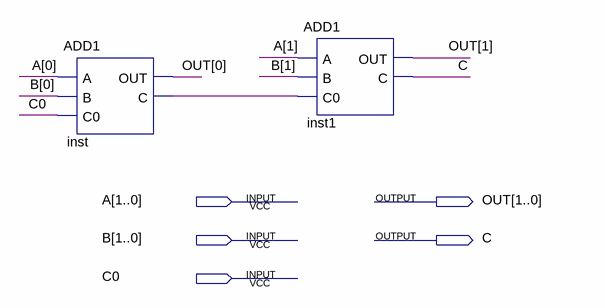
[diagram p0: schematic sheet]
// Quartus schematic ADD2.bdf as structural Verilog: 2 symbols, 5 pins
module ADD2 (
  input  [1:0] A,
  input  [1:0] B,
  input  C0,
  output [1:0] OUT,
  output C
);

  wire inst_c;

  ADD1 inst (.A(A[0]), .B(B[0]), .C0(C0), .OUT(OUT[0]), .C(inst_c));
  ADD1 inst1 (.A(A[1]), .B(B[1]), .C0(inst_c), .OUT(OUT[1]), .C(C));
endmodule
